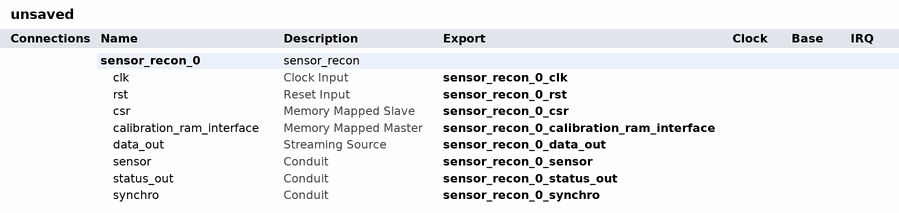
[diagram p0: system contents]
# Platform Designer (Qsys) system unsaved, MAX 10 10M50DAF484C6GES
# Parameters at their usual value, and those the tool derives, are not listed.
package require qsys
create_system unsaved
set_project_property DEVICE_FAMILY {MAX 10}
set_project_property DEVICE 10M50DAF484C6GES

add_instance sensor_recon_0 sensor_recon 1

# exported interfaces
add_interface sensor_recon_0_calibration_ram_interface avalon master
set_interface_property sensor_recon_0_calibration_ram_interface EXPORT_OF sensor_recon_0.calibration_ram_interface
add_interface sensor_recon_0_clk clock sink
set_interface_property sensor_recon_0_clk EXPORT_OF sensor_recon_0.clk
add_interface sensor_recon_0_csr avalon slave
set_interface_property sensor_recon_0_csr EXPORT_OF sensor_recon_0.csr
add_interface sensor_recon_0_data_out avalon_streaming source
set_interface_property sensor_recon_0_data_out EXPORT_OF sensor_recon_0.data_out
add_interface sensor_recon_0_rst reset sink
set_interface_property sensor_recon_0_rst EXPORT_OF sensor_recon_0.rst
add_interface sensor_recon_0_sensor conduit end
set_interface_property sensor_recon_0_sensor EXPORT_OF sensor_recon_0.sensor
add_interface sensor_recon_0_status_out conduit end
set_interface_property sensor_recon_0_status_out EXPORT_OF sensor_recon_0.status_out
add_interface sensor_recon_0_synchro conduit end
set_interface_property sensor_recon_0_synchro EXPORT_OF sensor_recon_0.synchro

set_interconnect_requirement {$system} qsys_mm.clockCrossingAdapter HANDSHAKE
set_interconnect_requirement {$system} qsys_mm.enableEccProtection FALSE
set_interconnect_requirement {$system} qsys_mm.insertDefaultSlave FALSE
set_interconnect_requirement {$system} qsys_mm.maxAdditionalLatency 1

save_system unsaved.qsys
